# EAGLE design Opamp (EAGLE 7.2.0)
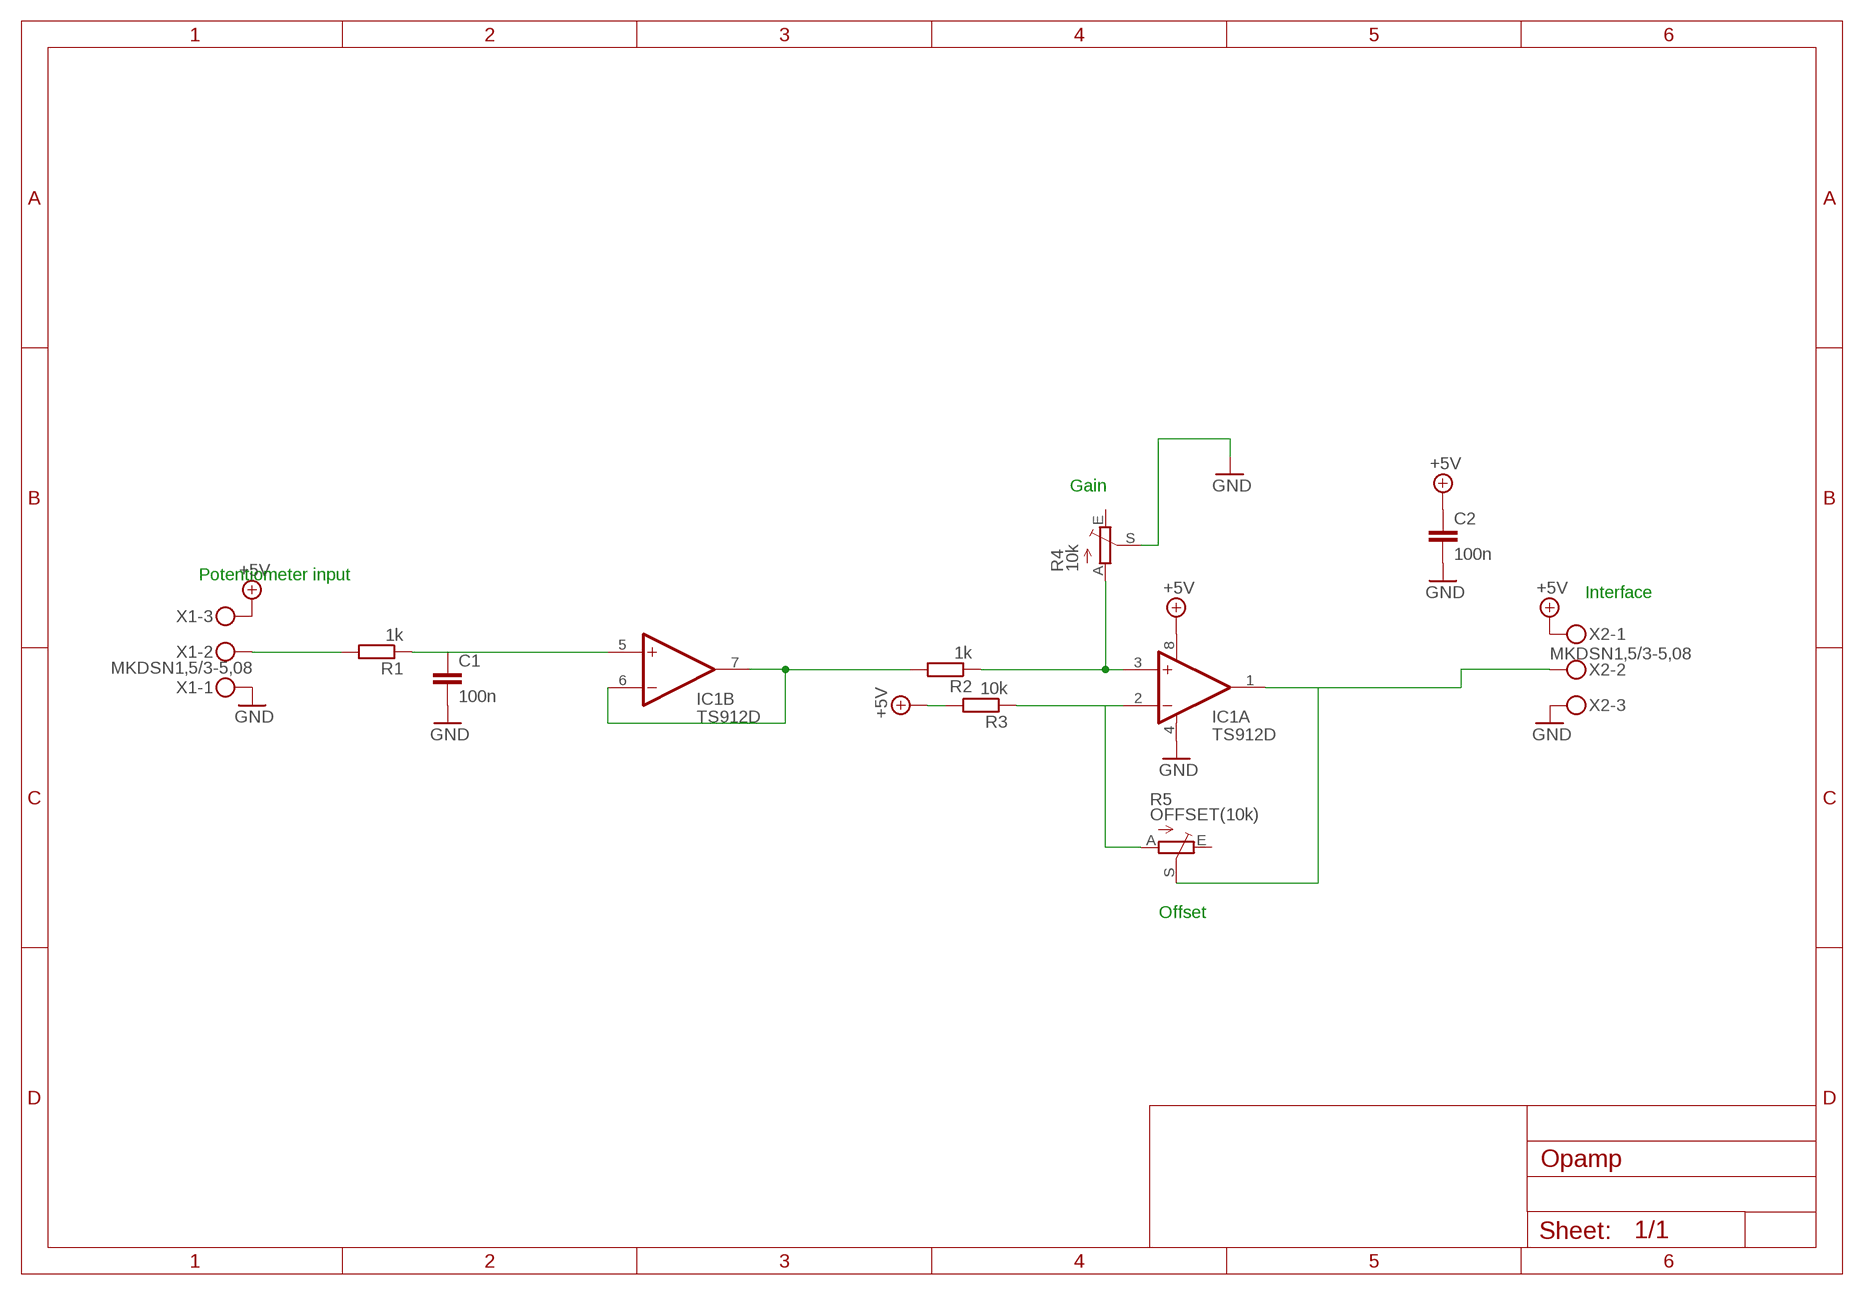
[diagram p0: schematic, sheet 1]

## Parts
C1  100n  C-EUC0805  [C0805]
C2  100n  C-EUC0805  [C0805]
IC1  TS912D  [SO08]
R1  1k  R-EU_R0805  [R0805]
R2  1k  R-EU_R0805  [R0805]
R3  10k  R-EU_R0805  [R0805]
R4  10k  TRIM_EU-S64W  [S64W]
R5  OFFSET(10k)  TRIM_EU-S64W  [S64W]
X1  MKDSN1,5/3-5,08  [MKDSN1,5/3-5,08]
X2  MKDSN1,5/3-5,08  [MKDSN1,5/3-5,08]

## Nets
+5V: C2.1 IC1.8(A:V+) R3.2 X1.3 X2.1
GND: C1.2 C2.2 IC1.4(A:V-) R4.S X1.1 X2.3
N$1: IC1.2(A:-IN) R3.1 R5.A
N$2: C1.1 IC1.5(B:+IN) R1.1
N$3: IC1.1(A:OUT) R5.S X2.2
N$4: IC1.3(A:+IN) R2.1 R4.A
N$5: IC1.6(B:-IN) IC1.7(B:OUT) R2.2
N$6: R1.2 X1.2
Unconnected: R4.E R5.E

## Notes on the sheet
- Gain
- Potentiometer input
- Interface
- Offset

## Library data of the parts
C1 C2 = rcl:C-EU: CAPACITOR, European symbol
IC1 = satnogs:TS912: Dual Operational Amplifiers Source: http://www.st.com/stonline/products/literature/ds/2325/ts912.pdf Over-the-rail, single supply, only in SMD technology; MPN: TS912IDT; OC_FARNELL: 1642723; OC_NEWARK: unknown; OC_REICHELT: TS 912 D
R1-R3 = rcl:R-EU_: RESISTOR, European symbol
R4 R5 = pot:TRIM_EU-: POTENTIOMETER
X1 X2 = con-phoenix-508:MKDSN1,5/3-5,08: MKDSN 1,5/ 3-5,08 Printklemme Nennstrom: 13,5 A Nennspannung: 250 V Rastermaß: 5,08 mm Polzahl: 3 Anschlussart: Schraubanschluss Montage: Löten Anschlussrichtung Leiter/Platine: 0 ° Artikelnummer: 1729131 Source: http://eshop.phoenixcontact.com .. 1729131.pdf

## Board
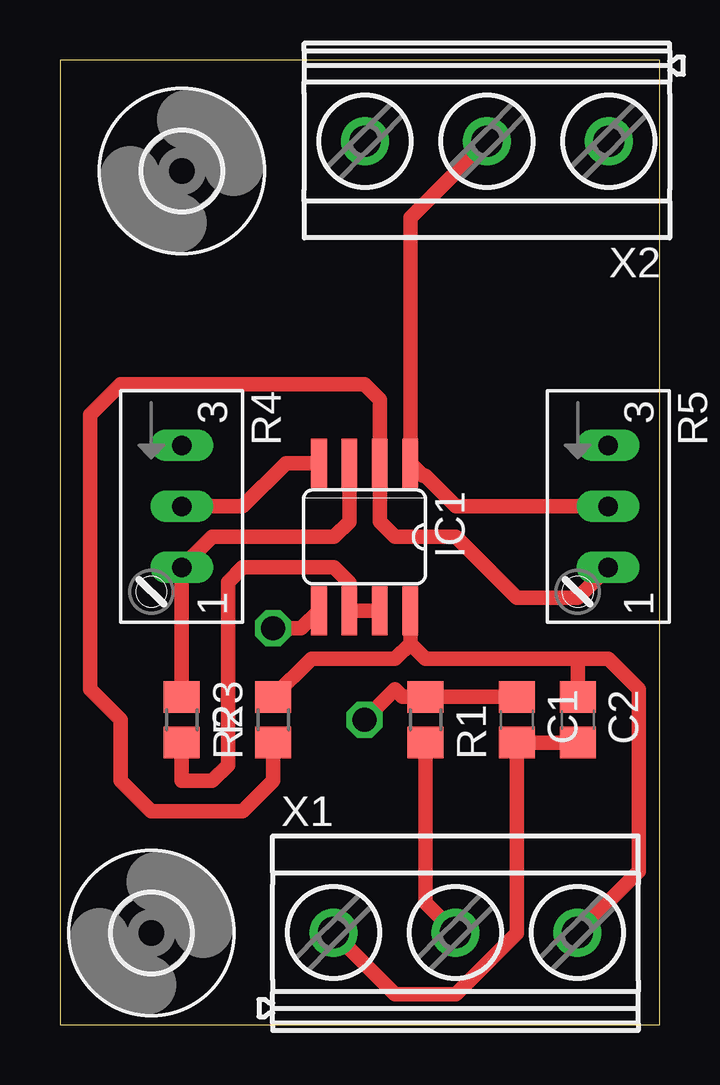
[diagram p1: board, top side]
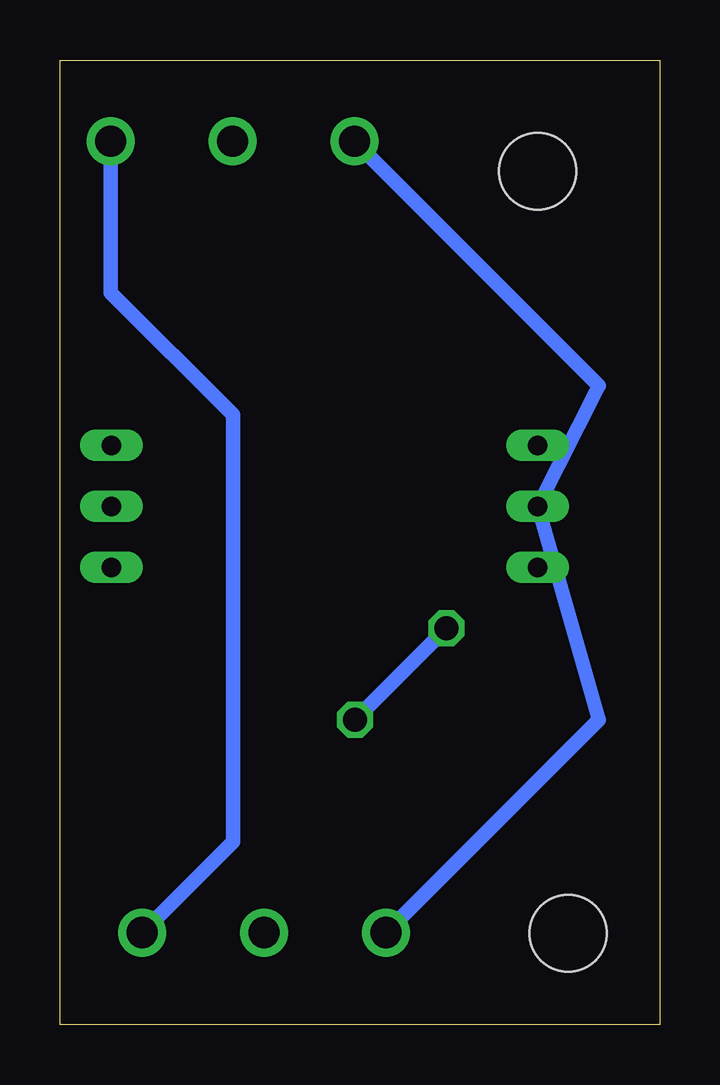
[diagram p2: board, bottom side, seen from below]

Size 25 x 40.19 mm. Coordinates in mm from the lower left corner, seen from the top.
Outline: 0,0 25,0 25,40.19 0,40.19 0,0
Copper layers (1*16): Top 0.035mm / dielectric 1.5mm / Bottom 0.035mm
Design rules "default": minimum track width 10mil, minimum drill 24mil, track to track 8mil, track to pad 8mil, pad to pad 8mil, via to via 8mil, smd to smd 8mil, copper to edge 40mil, drill to drill 8mil, minimum pad ring 10mil, minimum via ring 8mil, stop-mask expansion 4mil, vias tented up to drill 0mil, thermal gap 10mil

### Footprints (pad centres in the part's own frame; a part is rotated, then mirrored left to right if it is on the bottom)
C0805 = smd 1.3 x 1.5: 1 -0.95,0; 2 0.95,0
SO08 = smd 0.66 x 2.032: 1 -1.905,-3.073; 2 -0.635,-3.073; 3 0.635,-3.073; 4 1.905,-3.073; 5 1.905,3.073; 6 0.635,3.073; 7 -0.635,3.073; 8 -1.905,3.073
R0805 = smd 1.3 x 1.5: 1 -0.95,0; 2 0.95,0
S64W = drill 0.813 long: A 2.54,1.27; E -2.54,1.27; S 0,1.27
3,2 = hole 3.2: 0,0
MKDSN1,5/3-5,08 = drill 1.3 pad 2: 1 -7.641,0.025; 2 -2.561,0.025; 3 2.519,0.025

### Placement (x,y rotation side)
C1  19.05,12.7 270 top
C2  21.59,12.7 270 top
IC1  12.7,20.32 180 top
R1  15.24,12.7 270 top
R2  5.08,12.7 270 top
R3  8.89,12.7 90 top
R4  3.81,21.59 270 top
R5  21.59,21.59 270 top
U$1  [3,2]  3.81,3.81 0 top
U$2  [3,2]  5.08,35.56 0 top
X1  19.05,3.81 0 top
X2  15.24,36.83 180 top

### Tracks (layer width: path | path; a pad name or v marks a point on that pad's centre or on a via)
+5V
  Top 0.61: R3.2 10.48,15.24 13.97,15.24 14.61,15.88 | 14.61,15.88 IC1.8 | X1.3 24.13,6.4 24.13,13.97 22.86,15.24 21.59,15.24 | 21.59,15.24 15.24,15.24 14.61,15.88 | C2.1 21.59,15.24
  Bottom 0.61: X2.1 22.88,30.5 17.78,25.4 17.78,7.62 X1.3
GND
  Top 0.61: R4.S 7.62,21.59 9.42,23.39 IC1.4 | X1.1 13.97,1.27 16.51,1.27 19.05,3.81 C1.2 C2.2
  Bottom 0.61: X2.3 2.54,26.62 R4.S 2.54,12.7 X1.1
N$1
  Top 0.61: R3.1 8.89,10.16 7.62,8.89 3.81,8.89 2.54,10.16 2.54,12.7 1.27,13.97 1.27,25.4 2.54,26.67 12.7,26.67 13.34,26.04 IC1.2 13.34,20.95 13.97,20.32 16.51,20.32 19.05,17.78 21.59,17.78 R5.A
N$2  (via drill 1)
  Top 0.61: C1.1 R1.1 14.29,13.65 13.97,13.97 v12.7,12.7 | IC1.5 10.06,16.51 v8.89,16.51
  Bottom 0.61: v8.89,16.51 v12.7,12.7
N$3
  Top 0.61: R5.S 16.51,21.59 15.24,22.86 15.14,22.86 IC1.1 14.61,33.61 X2.2
N$4
  Top 0.61: IC1.3 12.06,20.95 11.43,20.32 6.35,20.32 R4.A R2.1
N$5
  Top 0.61: IC1.7 IC1.6 12.06,18.41 11.43,19.05 7.62,19.05 7,18.43 7,10.81 6.35,10.16 5.08,10.16 R2.2
N$6
  Top 0.61: X1.2 15.24,5.08 R1.2